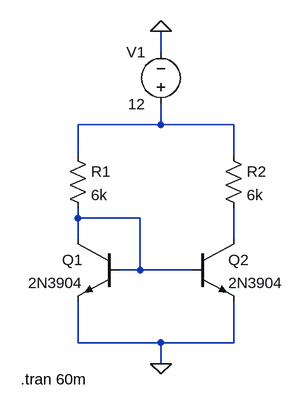
[diagram p0: schematic Current_MIrror_Using_BJT.asc]
Current_MIrror_Using_BJT.asc, the LTspice schematic file:
Version 4.1
SHEET 1 880 680
WIRE 256 -144 256 -176
WIRE 256 -32 256 -64
WIRE 256 -32 128 -32
WIRE 368 -32 256 -32
WIRE 128 16 128 -32
WIRE 368 16 368 -32
WIRE 128 112 128 96
WIRE 224 112 128 112
WIRE 128 144 128 112
WIRE 368 144 368 96
WIRE 224 192 224 112
WIRE 224 192 192 192
WIRE 304 192 224 192
WIRE 128 304 128 240
WIRE 256 304 128 304
WIRE 368 304 368 240
WIRE 368 304 256 304
WIRE 256 336 256 304
FLAG 256 336 0
FLAG 256 -176 0
SYMBOL npn 192 144 M0
SYMATTR InstName Q1
SYMATTR Value 2N3904
SYMBOL npn 304 144 R0
SYMATTR InstName Q2
SYMATTR Value 2N3904
SYMBOL res 112 0 R0
SYMATTR InstName R1
SYMATTR Value 6k
SYMBOL res 352 0 R0
SYMATTR InstName R2
SYMATTR Value 6k
SYMBOL voltage 256 -48 R180
WINDOW 0 24 96 Left 2
WINDOW 3 24 16 Left 2
WINDOW 123 0 0 Left 0
WINDOW 39 0 0 Left 0
SYMATTR InstName V1
SYMATTR Value 12
TEXT 40 360 Left 2 !.tran 60m

The netlist it stands for:
* Current_MIrror_Using_BJT.asc
Q1 N002 N002 0 0 2N3904
Q2 N003 N002 0 0 2N3904
R1 N001 N002 6k
R2 N001 N003 6k
V1 N001 0 12
.model NPN NPN
.model PNP PNP
.lib standard.bjt
.tran 60m
.backanno
.end